# Altium schematic sheet 32-041原理图（源文件格式）.SchDoc
size A4
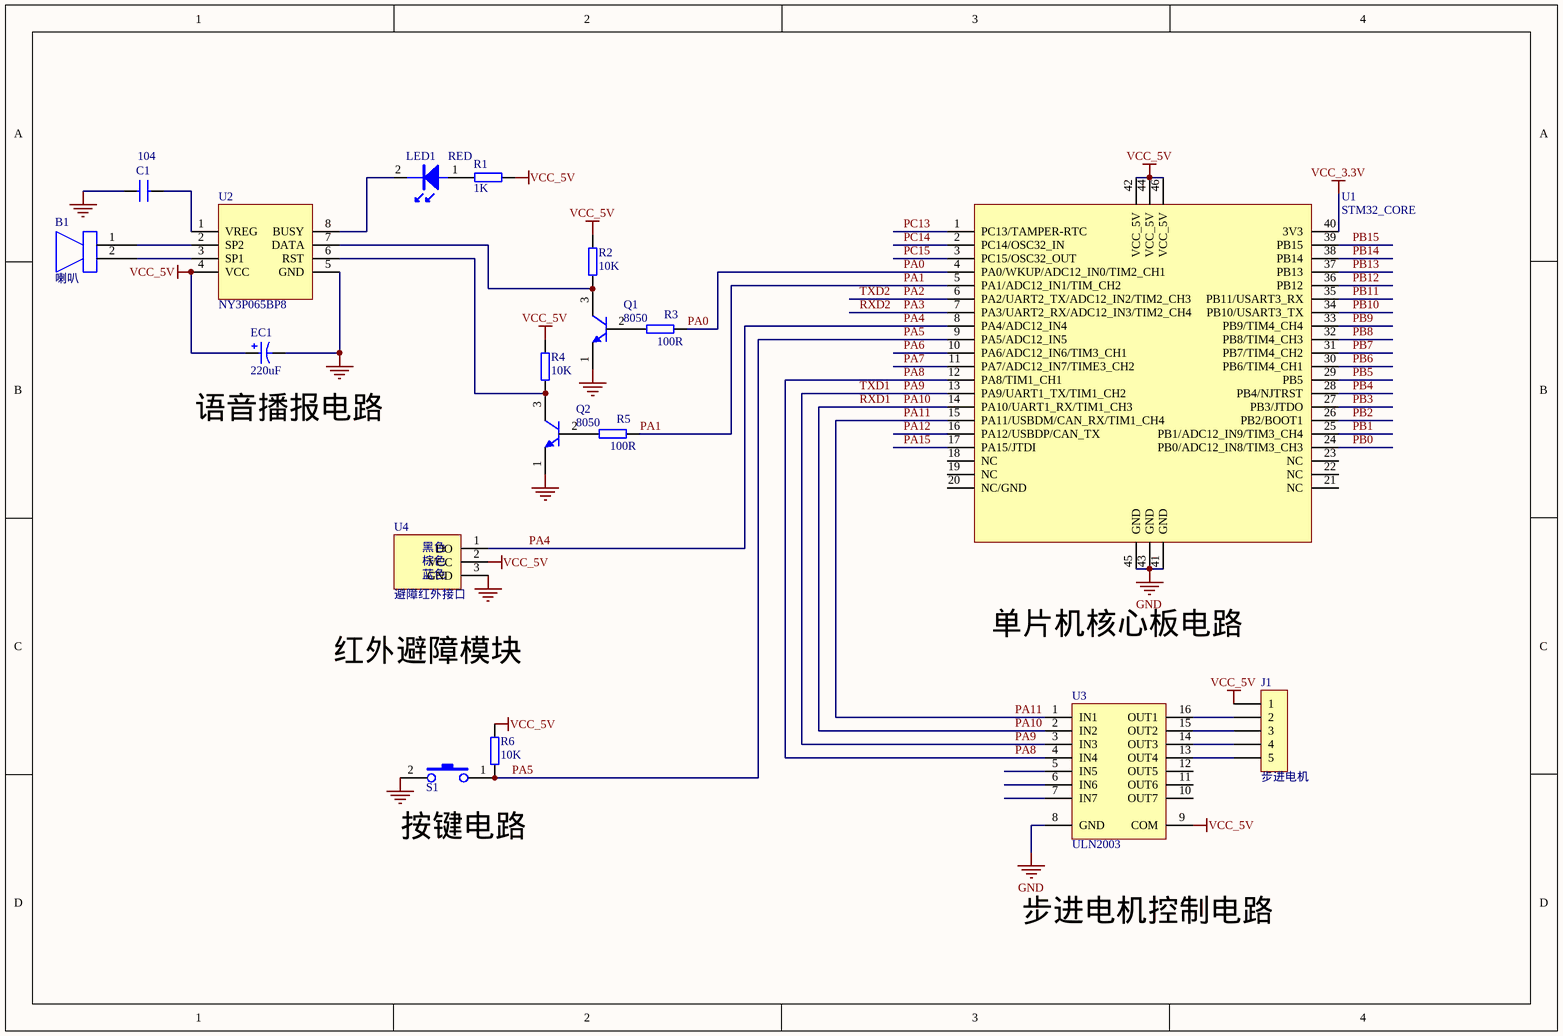
[diagram p0: 32-041原理图（源文件格式）.SchDoc]

## Parts
B1  喇叭  [喇叭]
C1  104  [RAD-0.1]
EC1  220uF  [RB.15/.3]
J1  步进电机  [SIP5-2.54]
LED1  RED  [LED_D3MM12]
Q1  8050  [TO-92]
Q2  8050  [TO-92]
R1  1K  [AXIAL0.3]
R2  10K  [AXIAL0.3]
R3  100R  [AXIAL0.3]
R4  10K  [AXIAL0.3]
R5  100R  [AXIAL0.3]
R6  10K  [AXIAL0.3]
S1  BUTTOM  [BUTTOM_6x6DIP]  (value not drawn)
U1  STM32_CORE  [STM32_CORE]
U2  NY3P065BP8  [DIP8]
U3  ULN2003  [DIP16]
U4  避障红外接口  [红外接口]

## Nets
GND: C1.1 EC1.2 Q1.1 Q2.1 S1.2 U1.41(GND) U1.43(GND) U1.45(GND) U2.5(GND) U3.8(GND) U4.3(GND)
VCC_3.3V: U1.40(3V3)
VCC_5V: EC1.1 J1.1 R1.2 R2.2 R4.2 R6.2 U1.42(VCC_5V) U1.44(VCC_5V) U1.46(VCC_5V) U2.4(VCC) U3.9(COM) U4.2(VCC)
PA0: R3.1 U1.4(PA0/WKUP/ADC12_IN0/TIM2_CH1)
PA1: R5.1 U1.5(PA1/ADC12_IN1/TIM_CH2)
PA2: U1.6(PA2/UART2_TX/ADC12_IN2/TIM2_CH3)  [also labelled TXD2]
PA3: U1.7(PA3/UART2_RX/ADC12_IN3/TIM2_CH4)  [also labelled RXD2]
PA4: U1.8(PA4/ADC12_IN4) U4.1(DO)
PA5: R6.1 S1.1 U1.9(PA5/ADC12_IN5)
PA6: U1.10(PA6/ADC12_IN6/TIM3_CH1)
PA7: U1.11(PA7/ADC12_IN7/TIME3_CH2)
PA8: U1.12(PA8/TIM1_CH1) U3.4(IN4)
PA9: U1.13(PA9/UART1_TX/TIM1_CH2) U3.3(IN3)  [also labelled TXD1]
PA10: U1.14(PA10/UART1_RX/TIM1_CH3) U3.2(IN2)  [also labelled RXD1]
PA11: U1.15(PA11/USBDM/CAN_RX/TIM1_CH4) U3.1(IN1)
PA12: U1.16(PA12/USBDP/CAN_TX)
PA15: U1.17(PA15/JTDI)
PB0: U1.24(PB0/ADC12_IN8/TIM3_CH3)
PB1: U1.25(PB1/ADC12_IN9/TIM3_CH4)
PB2: U1.26(PB2/BOOT1)
PB3: U1.27(PB3/JTDO)
PB4: U1.28(PB4/NJTRST)
PB5: U1.29(PB5)
PB6: U1.30(PB6/TIM4_CH1)
PB7: U1.31(PB7/TIM4_CH2)
PB8: U1.32(PB8/TIM4_CH3)
PB9: U1.33(PB9/TIM4_CH4)
PB10: U1.34(PB10/USART3_TX)
PB11: U1.35(PB11/USART3_RX)
PB12: U1.36(PB12)
PB13: U1.37(PB13)
PB14: U1.38(PB14)
PB15: U1.39(PB15)
PC13: U1.1(PC13/TAMPER-RTC)
PC14: U1.2(PC14/OSC32_IN)
PC15: U1.3(PC15/OSC32_OUT)
NetB1_1: B1.1(+) U2.2(SP2)
NetB1_2: B1.2 U2.3(SP1)
NetC1_2: C1.2 U2.1(VREG)
NetJ1_2: J1.2 U3.16(OUT1)
NetJ1_3: J1.3 U3.15(OUT2)
NetJ1_4: J1.4 U3.14(OUT3)
NetJ1_5: J1.5 U3.13(OUT4)
NetLED1_1: LED1.1 R1.1
NetLED1_2: LED1.2 U2.8(BUSY)
NetQ1_2: Q1.2 R3.2
NetQ1_3: Q1.3 R2.1 U2.7(DATA)
NetQ2_2: Q2.2 R5.2
NetQ2_3: Q2.3 R4.1 U2.6(RST)

Not connected (* = marked no-connect by the designer): U1 18(NC) 19(NC) 20(NC/GND) 21(NC) 22(NC) 23(NC); U3 5(IN5) 6(IN6) 7(IN7) 10(OUT7) 11(OUT6) 12(OUT5)

## Notes on the sheet
- (near EC1) 语音播报电路
- 单片机核心板电路
- 红外避障模块
- (near S1) 按键电路
- 步进电机控制电路
- (in symbol 避障红外接口) 黑色; 棕色; 蓝色

## Library data of the parts
C1 = CAP: 无极性电容
EC1 = CAP_EC: 极性电容
J1 = 步进电机: 步进电机接口
LED1 = LED12: LED灯
Q1 Q2 = 9013: 三极管
R1-R6 = RES: 电阻
S1 = BUTTOM: 按键
U1 = STM32_CORE: STM32核心板
U2 = NY3P065BP8: 语音芯片
U3 = ULN2003A: ULN2003芯片
U4 = 避障红外接口: 避障红外探头模块